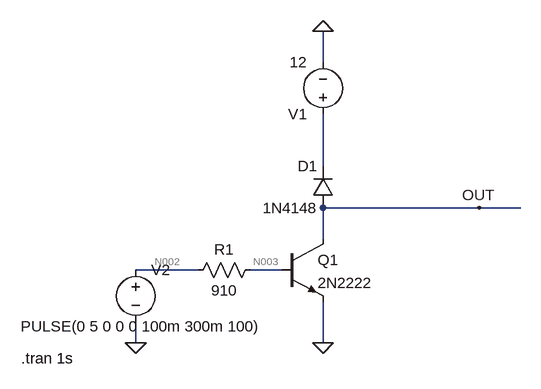
[diagram p0: schematic Draft2.asc]
Draft2.asc, the LTspice schematic file:
Version 4
SHEET 1 880 680
WIRE 368 -128 368 -176
WIRE 368 32 368 -48
WIRE 608 96 368 96
WIRE 672 96 608 96
WIRE 368 144 368 96
WIRE 176 192 80 192
WIRE 304 192 256 192
WIRE 80 304 80 272
WIRE 368 304 368 240
FLAG 368 304 0
FLAG 368 -176 0
FLAG 80 304 0
FLAG 608 96 OUT
SYMBOL diode 384 96 R180
WINDOW 0 24 64 Left 2
WINDOW 3 24 0 Left 2
SYMATTR InstName D1
SYMATTR Value 1N4148
SYMBOL npn 304 144 R0
SYMATTR InstName Q1
SYMATTR Value 2N2222
SYMBOL res 272 176 R90
WINDOW 0 0 56 VBottom 2
WINDOW 3 32 56 VTop 2
SYMATTR InstName R1
SYMATTR Value 910
SYMBOL voltage 368 -32 R180
WINDOW 123 0 0 Left 0
WINDOW 39 0 0 Left 0
SYMATTR InstName V1
SYMATTR Value 12
SYMBOL voltage 80 176 R0
WINDOW 3 -177 103 Left 2
WINDOW 123 0 0 Left 0
WINDOW 39 0 0 Left 0
SYMATTR InstName V2
SYMATTR Value PULSE(0 5 0 0 0 100m 300m 100)
TEXT -96 328 Left 2 !.tran 1s

The netlist it stands for:
* Draft2.asc
D1 OUT N001 1N4148
Q1 OUT N003 0 0 2N2222
R1 N003 N002 910
V1 N001 0 12
V2 N002 0 PULSE(0 5 0 0 0 100m 300m 100)
.model D D
.lib standard.dio
.model NPN NPN
.model PNP PNP
.lib standard.bjt
.tran 1s
.backanno
.end

* Results of the author's LTspice run, read from the files saved beside the schematic
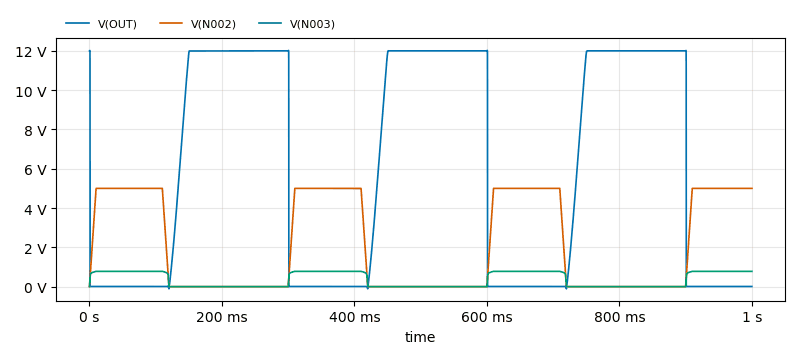
[diagram p1: Transient Analysis of Draft2.asc, plotted from the saved traces]
* Transient Analysis, 1 run:
*   V(OUT): min -109.9 mV, max 12.02 V, average 5.954 V, rms 8.328 V, last 8.792 mV
*   V(N002): min 0 V, max 5 V, average 2.125 V, rms 3.216 V, last 5 V
*   V(N003): min -619.8 nV, max 777.9 mV, average 350.6 mV, rms 519.2 mV, last 777.9 mV